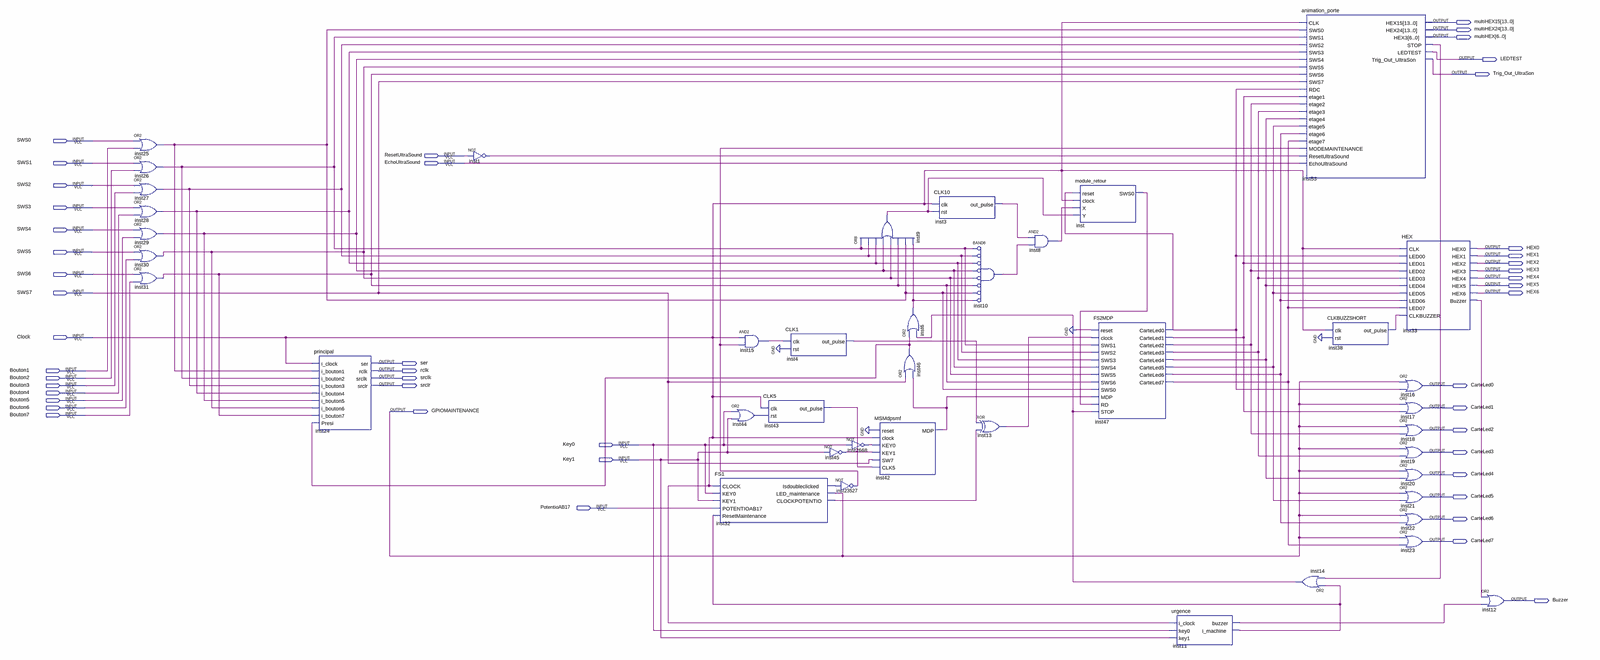
[diagram p0: schematic sheet, whole]
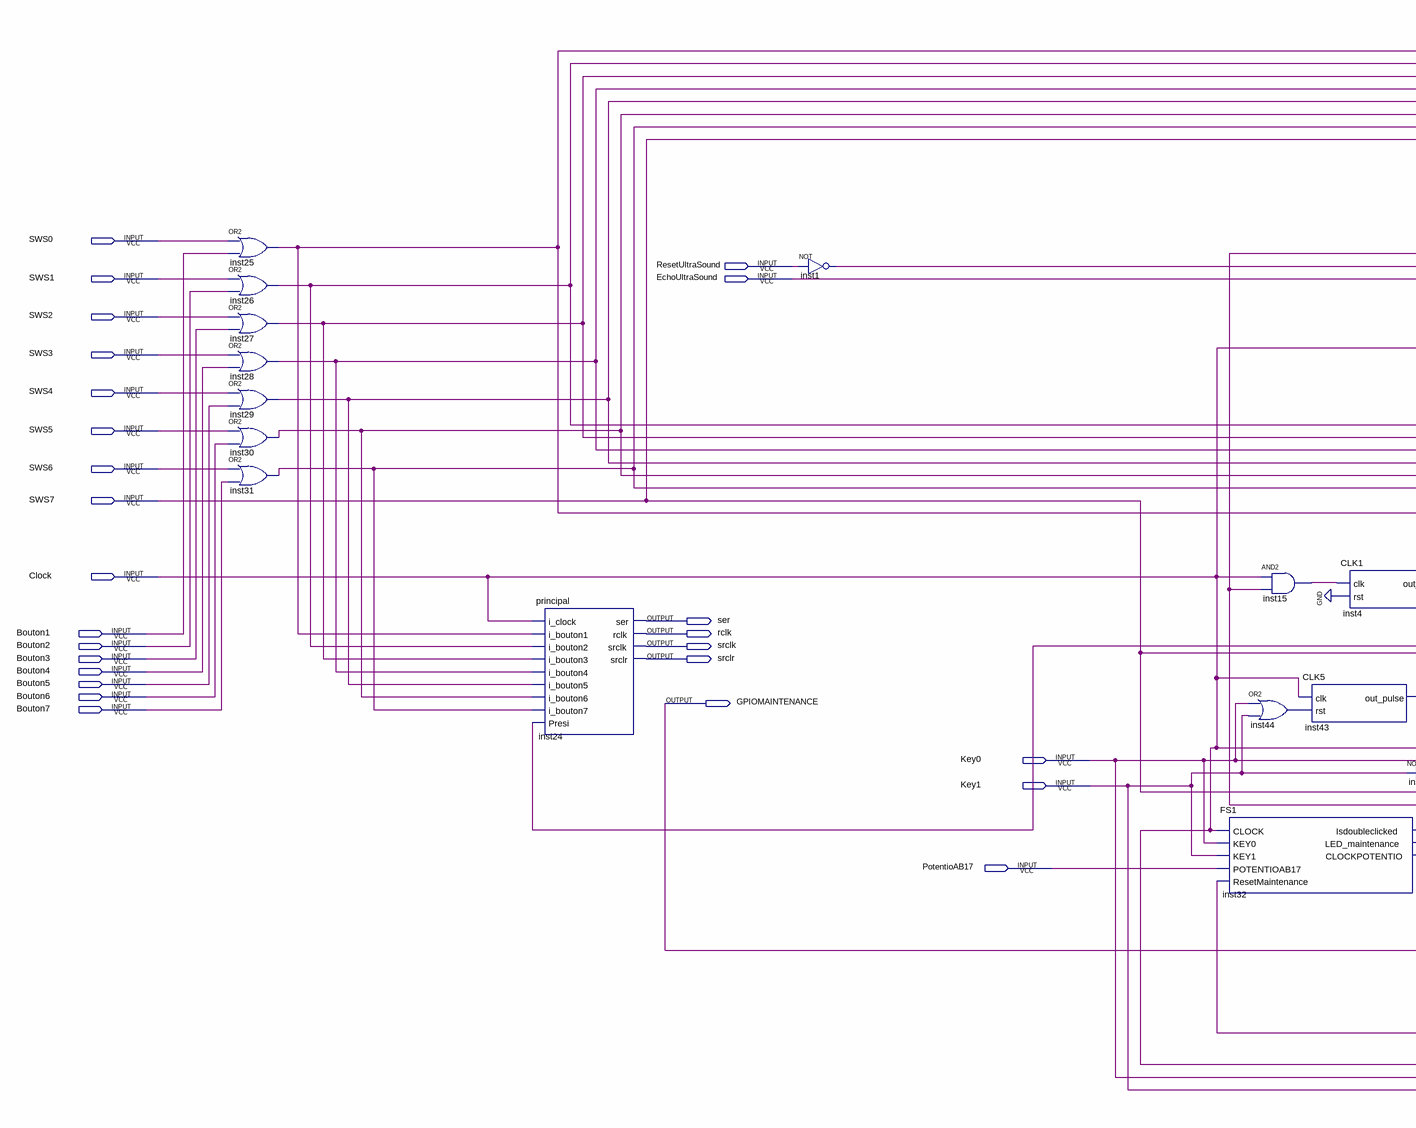
[diagram p1: schematic sheet, left part]
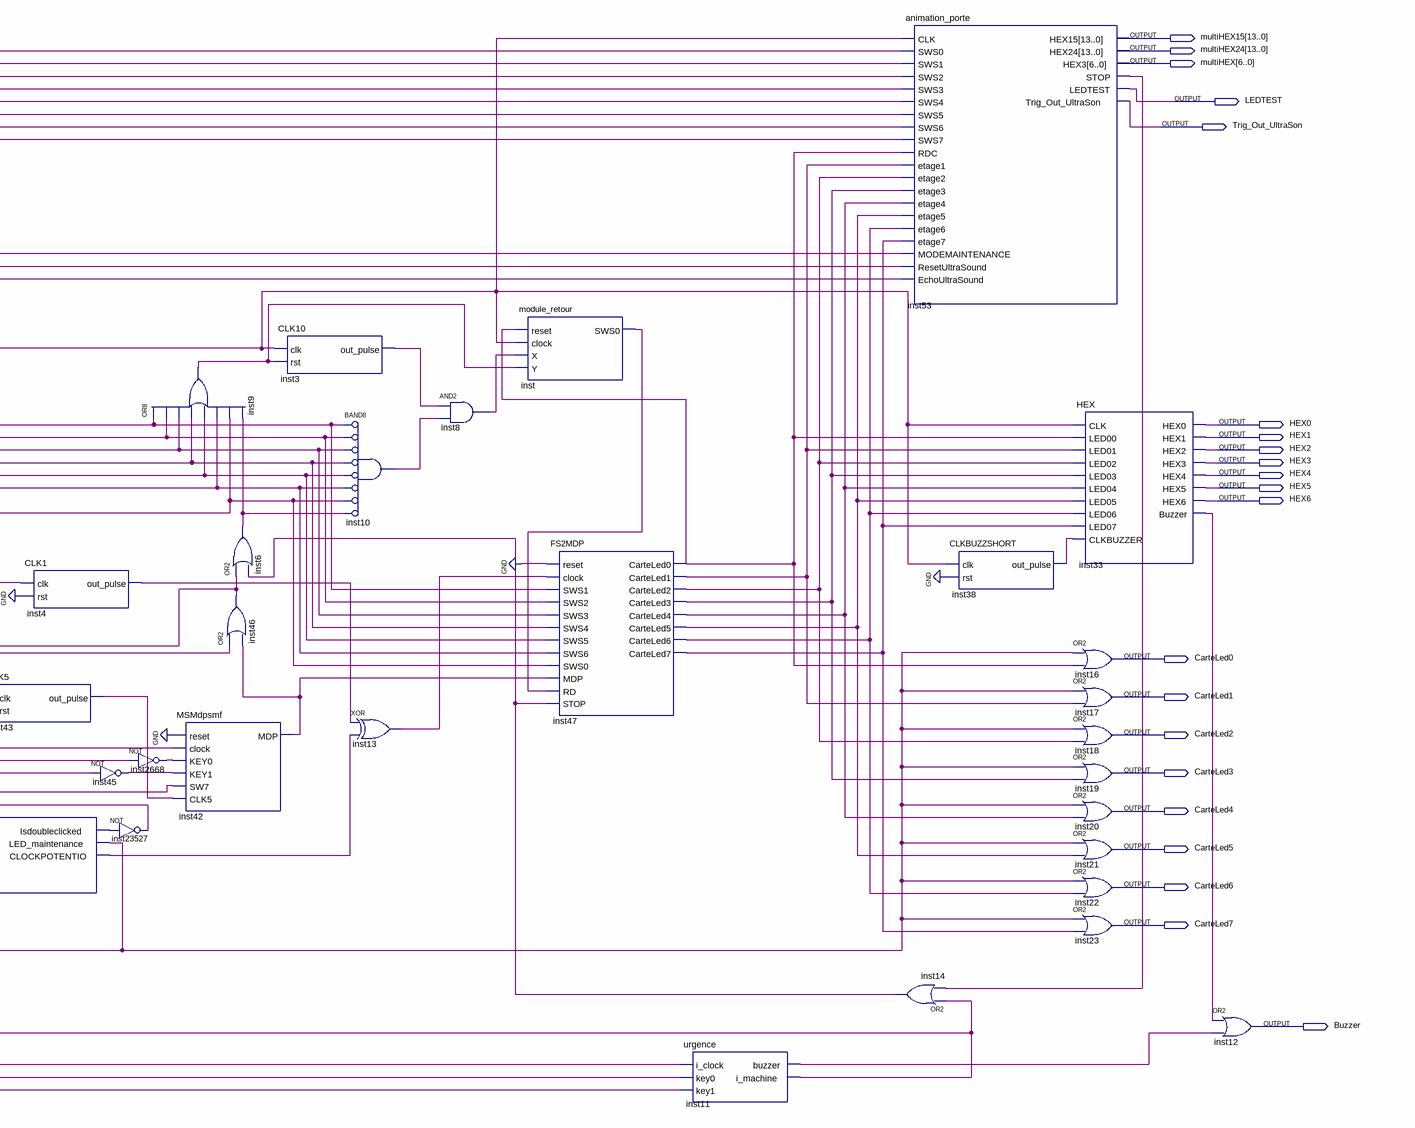
[diagram p2: schematic sheet, right part]
// Quartus schematic FINAL.bdf as structural Verilog: 41 symbols, 47 pins
module FINAL (
  input  SWS0,
  input  ResetUltraSound,
  input  SWS1,
  input  EchoUltraSound,
  input  SWS2,
  input  SWS3,
  input  SWS4,
  input  SWS5,
  input  SWS6,
  input  SWS7,
  input  Clock,
  input  Bouton1,
  input  Bouton2,
  input  Bouton3,
  input  Bouton4,
  input  Bouton5,
  input  Bouton6,
  input  Bouton7,
  input  Key0,
  input  Key1,
  input  PotentioAB17,
  output [13:0] multiHEX15,
  output [13:0] multiHEX24,
  output [6:0] multiHEX,
  output LEDTEST,
  output Trig_Out_UltraSon,
  output HEX0,
  output HEX1,
  output HEX2,
  output HEX3,
  output HEX4,
  output HEX5,
  output HEX6,
  output ser,
  output rclk,
  output srclk,
  output srclr,
  output CarteLed0,
  output CarteLed1,
  output GPIOMAINTENANCE,
  output CarteLed2,
  output CarteLed3,
  output CarteLed4,
  output CarteLed5,
  output CarteLed6,
  output CarteLed7,
  output Buzzer
);

  wire inst1_out, inst3_out_pulse, inst4_out_pulse, inst6_out, inst8_out, inst9_out, inst10_out,
       inst11_buzzer, inst11_i_machine, inst13_out, inst14_out, inst15_out, inst25_out, inst26_out,
       inst27_out, inst28_out, inst29_out, inst30_out, inst31_out, inst32_clockpotentio,
       inst32_isdoubleclicked, inst33_buzzer, inst38_out_pulse, inst42_mdp, inst43_out_pulse, inst44_out,
       inst45_out, inst46_out, inst47_carteled0, inst47_carteled1, inst47_carteled2, inst47_carteled3,
       inst47_carteled4, inst47_carteled5, inst47_carteled6, inst47_carteled7, inst53_stop, inst2668_out,
       inst23527_out, inst_sws0;

  or inst25 (inst25_out, SWS0, Bouton1);
  or inst26 (inst26_out, SWS1, Bouton2);
  or inst27 (inst27_out, SWS2, Bouton3);
  or inst28 (inst28_out, SWS3, Bouton4);
  or inst29 (inst29_out, SWS4, Bouton5);
  or inst30 (inst30_out, SWS5, Bouton6);
  or inst31 (inst31_out, SWS6, Bouton7);
  principal inst24 (
    .i_clock(Clock), .i_bouton1(inst25_out), .i_bouton2(inst26_out), .i_bouton3(inst27_out),
    .i_bouton4(inst28_out), .i_bouton5(inst29_out), .i_bouton6(inst30_out), .i_bouton7(inst31_out),
    .Presi(inst46_out), .ser(ser), .rclk(rclk), .srclk(srclk), .srclr(srclr));
  not inst1 (inst1_out, ResetUltraSound);
  FS1 inst32 (
    .CLOCK(Clock), .KEY0(Key0), .KEY1(Key1), .POTENTIOAB17(PotentioAB17),
    .ResetMaintenance(inst11_i_machine), .Isdoubleclicked(inst32_isdoubleclicked),
    .LED_maintenance(GPIOMAINTENANCE), .CLOCKPOTENTIO(inst32_clockpotentio));
  and inst15 (inst15_out, Clock, inst23527_out);
  or inst44 (inst44_out, Key0, Key1);
  CLK1 inst4 (.clk(inst15_out), .rst(1'b0), .out_pulse(inst4_out_pulse));
  CLK5 inst43 (.clk(Clock), .rst(inst44_out), .out_pulse(inst43_out_pulse));
  not inst2668 (inst2668_out, Key0);
  not inst45 (inst45_out, Key1);
  not inst23527 (inst23527_out, inst32_isdoubleclicked);
  or inst9 (inst9_out, inst26_out, inst27_out, inst28_out, inst29_out, inst30_out, inst31_out, inst25_out, inst6_out);
  MSMdpsmf inst42 (
    .reset(1'b0), .clock(Clock), .KEY0(inst2668_out), .KEY1(inst45_out), .SW7(SWS7), .CLK5(inst43_out_pulse),
    .MDP(inst42_mdp));
  or inst6 (inst6_out, inst46_out, inst14_out);
  or inst46 (inst46_out, SWS7, inst42_mdp);
  CLK10 inst3 (.clk(Clock), .rst(inst9_out), .out_pulse(inst3_out_pulse));
  and inst10 (inst10_out, ~inst26_out, ~inst27_out, ~inst28_out, ~inst29_out, ~inst30_out, ~inst31_out, ~inst25_out, ~inst6_out);  // BAND8
  xor inst13 (inst13_out, inst4_out_pulse, inst32_clockpotentio);
  and inst8 (inst8_out, inst3_out_pulse, inst10_out);
  module_retour inst (.reset(inst47_carteled0), .clock(Clock), .X(inst8_out), .Y(inst9_out), .SWS0(inst_sws0));
  FS2MDP inst47 (
    .reset(1'b0), .clock(inst13_out), .SWS1(inst26_out), .SWS2(inst27_out), .SWS3(inst28_out),
    .SWS4(inst29_out), .SWS5(inst30_out), .SWS6(inst31_out), .SWS0(inst25_out), .MDP(inst42_mdp),
    .RD(inst_sws0), .STOP(inst14_out), .CarteLed0(inst47_carteled0), .CarteLed1(inst47_carteled1),
    .CarteLed2(inst47_carteled2), .CarteLed3(inst47_carteled3), .CarteLed4(inst47_carteled4),
    .CarteLed5(inst47_carteled5), .CarteLed6(inst47_carteled6), .CarteLed7(inst47_carteled7));
  urgence inst11 (.i_clock(Clock), .key0(Key0), .key1(Key1), .buzzer(inst11_buzzer), .i_machine(inst11_i_machine));
  animation_porte inst53 (
    .CLK(Clock), .SWS0(inst25_out), .SWS1(inst26_out), .SWS2(inst27_out), .SWS3(inst28_out),
    .SWS4(inst29_out), .SWS5(inst30_out), .SWS6(inst31_out), .SWS7(SWS7), .RDC(inst47_carteled0),
    .etage1(inst47_carteled1), .etage2(inst47_carteled2), .etage3(inst47_carteled3),
    .etage4(inst47_carteled4), .etage5(inst47_carteled5), .etage6(inst47_carteled6),
    .etage7(inst47_carteled7), .MODEMAINTENANCE(inst23527_out), .ResetUltraSound(inst1_out),
    .EchoUltraSound(EchoUltraSound), .HEX15(multiHEX15), .HEX24(multiHEX24), .HEX3(multiHEX),
    .STOP(inst53_stop), .LEDTEST(LEDTEST), .Trig_Out_UltraSon(Trig_Out_UltraSon));
  or inst14 (inst14_out, inst11_i_machine, inst53_stop);
  CLKBUZZSHORT inst38 (.clk(Clock), .rst(1'b0), .out_pulse(inst38_out_pulse));
  HEX inst33 (
    .CLK(Clock), .LED00(inst47_carteled0), .LED01(inst47_carteled1), .LED02(inst47_carteled2),
    .LED03(inst47_carteled3), .LED04(inst47_carteled4), .LED05(inst47_carteled5), .LED06(inst47_carteled6),
    .LED07(inst47_carteled7), .CLKBUZZER(inst38_out_pulse), .HEX0(HEX0), .HEX1(HEX1), .HEX2(HEX2),
    .HEX3(HEX3), .HEX4(HEX4), .HEX5(HEX5), .HEX6(HEX6), .Buzzer(inst33_buzzer));
  or inst16 (CarteLed0, GPIOMAINTENANCE, inst47_carteled0);
  or inst17 (CarteLed1, GPIOMAINTENANCE, inst47_carteled1);
  or inst18 (CarteLed2, GPIOMAINTENANCE, inst47_carteled2);
  or inst19 (CarteLed3, GPIOMAINTENANCE, inst47_carteled3);
  or inst20 (CarteLed4, GPIOMAINTENANCE, inst47_carteled4);
  or inst21 (CarteLed5, GPIOMAINTENANCE, inst47_carteled5);
  or inst22 (CarteLed6, GPIOMAINTENANCE, inst47_carteled6);
  or inst23 (CarteLed7, GPIOMAINTENANCE, inst47_carteled7);
  or inst12 (Buzzer, inst33_buzzer, inst11_buzzer);
endmodule
